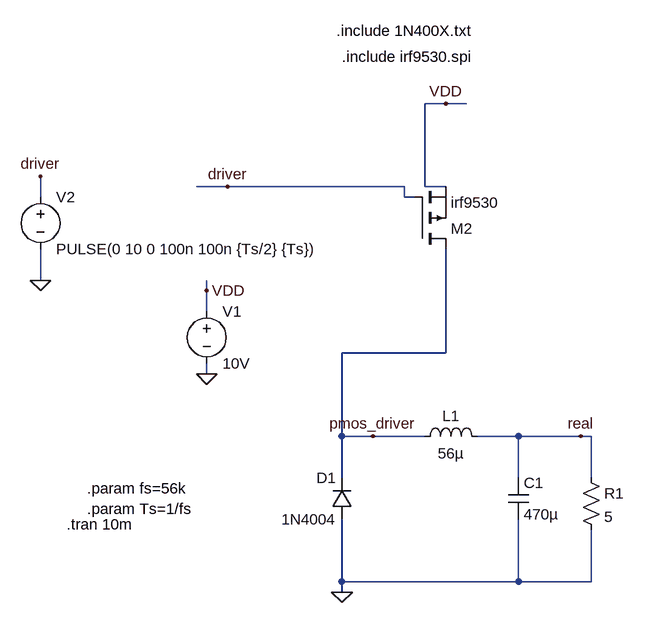
[diagram p0: schematic schem.asc]
schem.asc, the LTspice schematic file:
Version 4.1
SHEET 1 888 1092
WIRE 448 -208 416 -208
WIRE 480 -208 448 -208
WIRE 112 -80 64 -80
WIRE 384 -80 112 -80
WIRE 416 -80 416 -208
WIRE 448 -80 416 -80
WIRE -176 -64 -176 -96
WIRE 384 -64 384 -80
WIRE 400 -64 384 -64
WIRE -176 64 -176 16
WIRE 80 80 80 64
WIRE 80 112 80 80
WIRE 448 176 448 16
WIRE 448 176 288 176
WIRE 80 208 80 192
WIRE 288 304 288 176
WIRE 336 304 288 304
WIRE 416 304 336 304
WIRE 560 304 496 304
WIRE 656 304 560 304
WIRE 672 304 656 304
WIRE 288 368 288 304
WIRE 560 368 560 304
WIRE 672 368 672 304
WIRE 288 528 288 432
WIRE 560 528 560 432
WIRE 560 528 288 528
WIRE 672 528 672 448
WIRE 672 528 560 528
WIRE 288 544 288 528
FLAG 80 80 VDD
FLAG 448 -208 VDD
FLAG 288 544 0
FLAG 80 208 0
FLAG -176 64 0
FLAG -176 -96 driver
FLAG 112 -80 driver
FLAG 656 304 real
FLAG 336 304 pmos_driver
SYMBOL voltage 80 96 R0
WINDOW 123 0 0 Left 0
WINDOW 39 0 0 Left 0
SYMATTR InstName V1
SYMATTR Value 10V
SYMBOL ind 400 320 R270
WINDOW 0 32 56 VTop 2
WINDOW 3 5 56 VBottom 2
SYMATTR InstName L1
SYMATTR Value 56µ
SYMATTR SpiceLine Rser=0
SYMBOL cap 544 368 R0
SYMATTR InstName C1
SYMATTR Value 470µ
SYMBOL voltage -176 -80 R0
WINDOW 123 0 0 Left 0
WINDOW 39 0 0 Left 0
SYMATTR InstName V2
SYMATTR Value PULSE(0 10 0 100n 100n {Ts/2} {Ts})
SYMBOL res 656 352 R0
SYMATTR InstName R1
SYMATTR Value 5
SYMBOL pmos 400 16 M180
SYMATTR InstName M2
SYMATTR Value irf9530
SYMATTR Prefix X
SYMBOL diode 304 432 R180
WINDOW 0 24 64 Left 2
WINDOW 3 24 0 Left 2
SYMATTR InstName D1
SYMATTR Value 1N4004
TEXT -104 416 Left 2 !.param Ts=1/fs
TEXT -104 384 Left 2 !.param fs=56k
TEXT -136 440 Left 2 !.tran 10m
TEXT 288 -280 Left 2 !.include irf9530.spi
TEXT 280 -320 Left 2 !.include 1N400X.txt

The netlist it stands for:
* schem.asc
V1 VDD 0 10V
L1 pmos_driver real 56µ Rser=0
C1 real 0 470µ
V2 driver 0 PULSE(0 10 0 100n 100n {Ts/2} {Ts})
R1 real 0 5
X§M2 pmos_driver driver VDD irf9530  ; pins D G S
D1 0 pmos_driver 1N4004
.model D D
.lib standard.dio
.param Ts=1/fs
.param fs=56k
.tran 10m
.include irf9530.spi
.include 1N400X.txt
.backanno
.end